# EAGLE design MainSchematic_F1 (EAGLE 9.5.1)
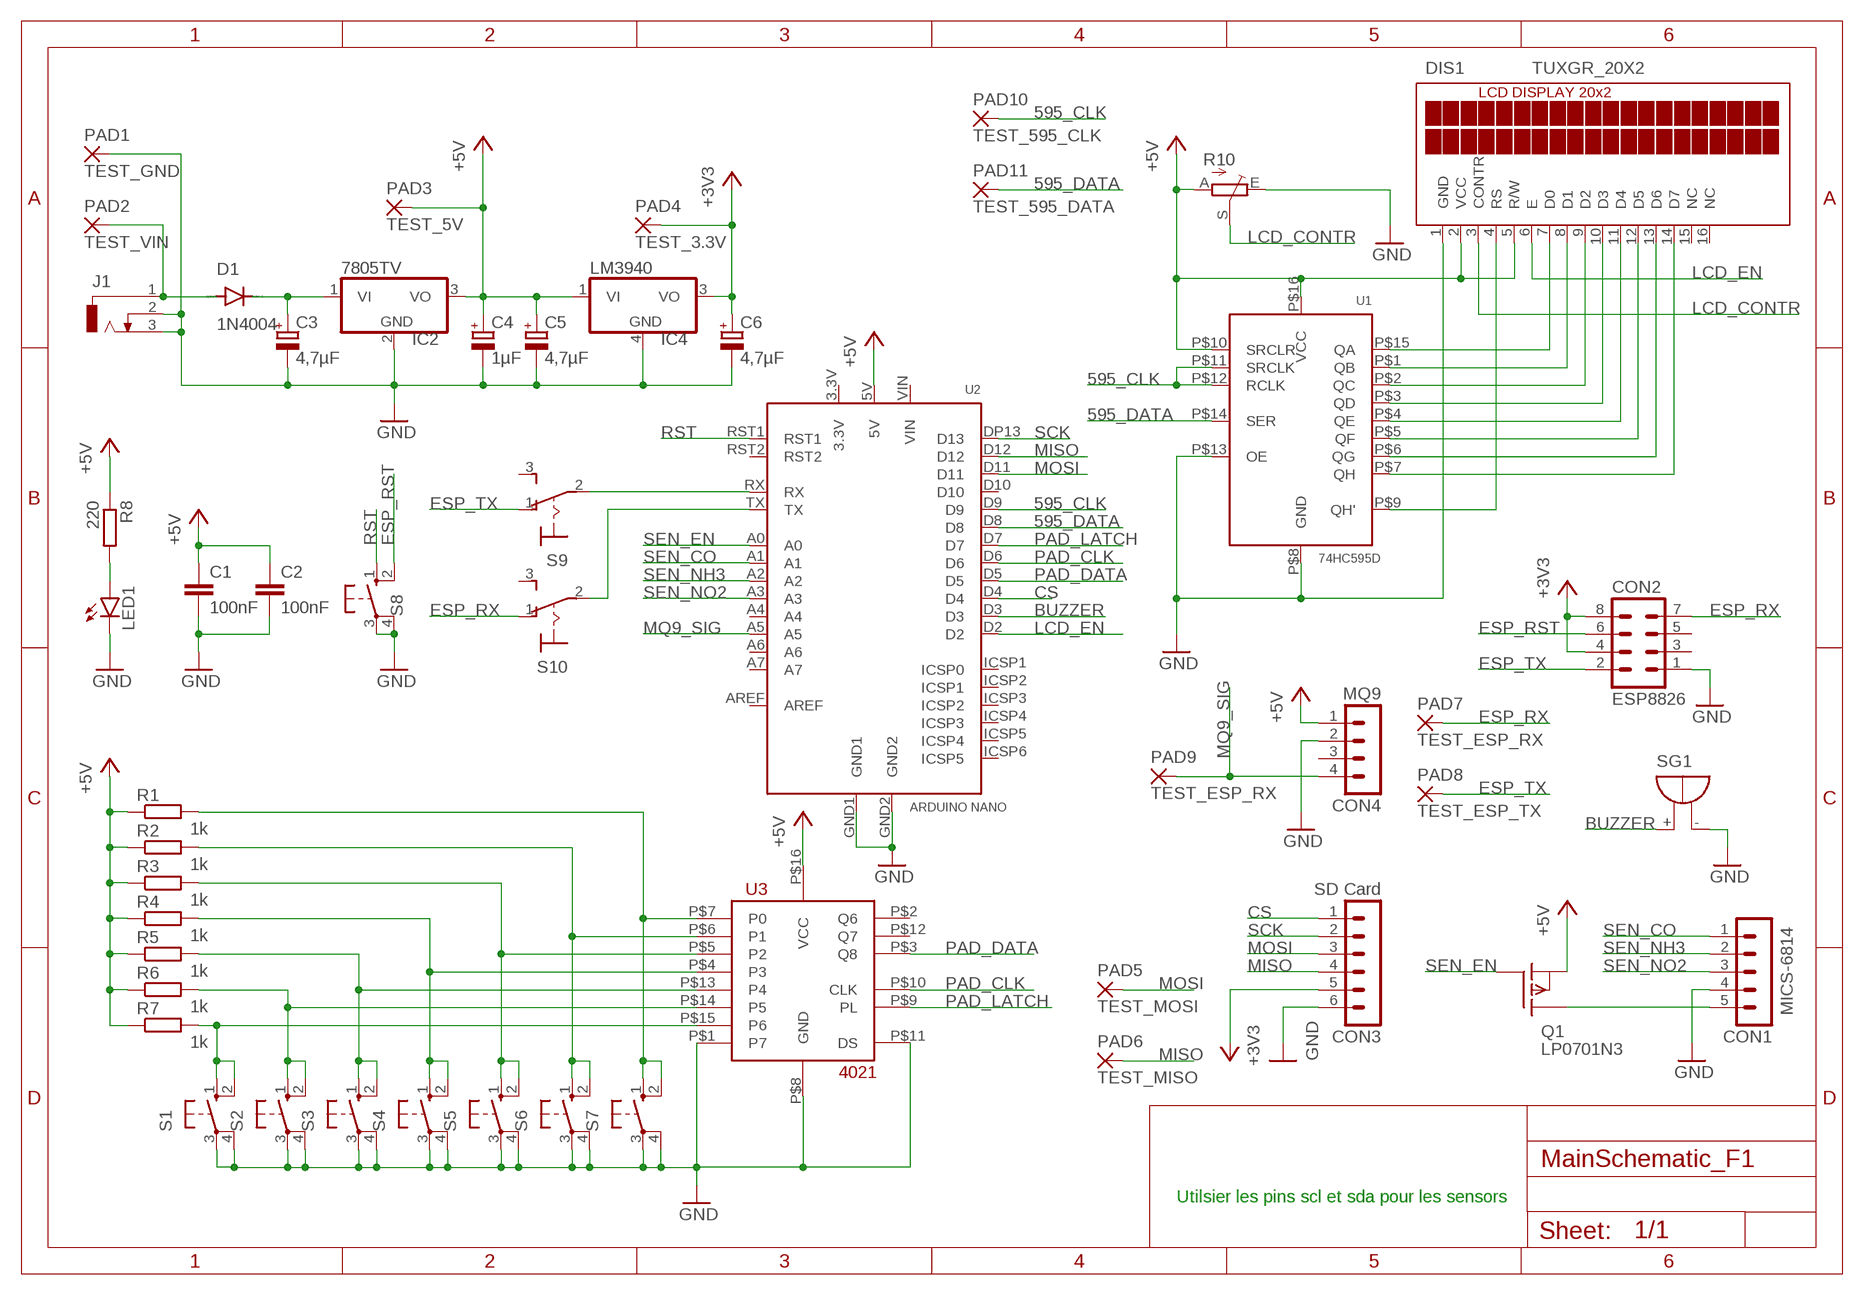
[diagram p0: schematic, sheet 1]

## Parts
C1  100nF  C5/2.5  [C5B2.5]
C2  100nF  C5/2.5  [C5B2.5]
C3  4,7µF  CPOL-EUE2,5-6E  [E2,5-6E]
C4  1µF  CPOL-EUE2,5-6E  [E2,5-6E]
C5  4,7µF  CPOL-EUE2,5-6E  [E2,5-6E]
C6  4,7µF  CPOL-EUE2,5-6E  [E2,5-6E]
CON1  MICS-6814  MA05-1  [MA05-1]
CON2  ESP8826  MA04-2  [MA04-2]
CON3  SD Card  MA06-1  [MA06-1]
CON4  MQ9  MA04-1  [MA04-1]
D1  1N4004  [DO41-10]
DIS1  TUXGR_20X2  [TUXGR_20X2]
IC2  7805TV  [TO220V]
IC4  LM3940  LM340MP-05  [SOT223]
J1  DCJ0303  [DCJ0303]
LED1  LED3MM  [LED3MM]
PAD1  TEST_GND  WIREPAD2,54/0,9  [2,54/0,9]
PAD2  TEST_VIN  WIREPAD2,54/0,9  [2,54/0,9]
PAD3  TEST_5V  WIREPAD2,54/0,9  [2,54/0,9]
PAD4  TEST_3.3V  WIREPAD2,54/0,9  [2,54/0,9]
PAD5  TEST_MOSI  WIREPAD2,54/0,9  [2,54/0,9]
PAD6  TEST_MISO  WIREPAD2,54/0,9  [2,54/0,9]
PAD7  TEST_ESP_RX  WIREPAD2,54/0,9  [2,54/0,9]
PAD8  TEST_ESP_TX  WIREPAD2,54/0,9  [2,54/0,9]
PAD9  TEST_ESP_RX  WIREPAD2,54/0,9  [2,54/0,9]
PAD10  TEST_595_CLK  WIREPAD2,54/0,9  [2,54/0,9]
PAD11  TEST_595_DATA  WIREPAD2,54/0,9  [2,54/0,9]
Q1  LP0701N3  [TO-92]
R1  1k  R-EU_0204/7  [0204/7]
R2  1k  R-EU_0204/7  [0204/7]
R3  1k  R-EU_0204/7  [0204/7]
R4  1k  R-EU_0204/7  [0204/7]
R5  1k  R-EU_0204/7  [0204/7]
R6  1k  R-EU_0204/7  [0204/7]
R7  1k  R-EU_0204/7  [0204/7]
R8  220  R-EU_0204/7  [0204/7]
R10  TRIM_EU-RJ9W  [RJ9W]
S1  10-XX  [B3F-10XX]
S2  10-XX  [B3F-10XX]
S3  10-XX  [B3F-10XX]
S4  10-XX  [B3F-10XX]
S5  10-XX  [B3F-10XX]
S6  10-XX  [B3F-10XX]
S7  10-XX  [B3F-10XX]
S8  10-XX  [B3F-10XX]
S9  320-916  [320-916]
S10  320-916  [320-916]
SG1  F/TMB  [F/TMB]
U1  74HC595D  74HC595D_SOP16  [SOP-16]
U2  ARDUINO NANO  ARDUINO_NANO_SOCKET  [SOCKET_NANO]
U3  4021  [DIP]

## Nets
595_CLK: PAD10.1(P) U1.P$11(SRCLK) U1.P$12(RCLK) U2.D9
595_DATA: PAD11.1(P) U1.P$14(SER) U2.D8
+3V3: C6.+ CON2.4 CON2.8 CON3.5 IC4.3(VO) PAD4.1(P)
+5V: C1.1 C2.1 C4.+ C5.+ CON4.1 DIS1.2(VCC) DIS1.5(R/W) IC2.3(VO) IC4.1(VI) PAD3.1(P) Q1.1(S) R1.1 R2.1 R3.1 R4.1 R5.1 R6.1 R7.1 R8.1 R10.A U1.P$10(SRCLR) U1.P$16(VCC) U2.5V U3.P$16(VCC)
BUZZER: SG1.+ U2.D3
CS: CON3.1 U2.D4
ESP_RST: CON2.6 S8.2(S1)
ESP_RX: CON2.7 PAD7.1(P) S10.1(O)
ESP_TX: CON2.2 PAD8.1(P) S9.1(O)
GND: C1.2 C2.2 C3.- C4.- C5.- C6.- CON1.4 CON2.1 CON3.6 CON4.2 DIS1.1(GND) IC2.2(GND) IC4.4(GND) J1.2 J1.3 LED1.K(C) PAD1.1(P) R10.E S1.3(P) S1.4(P1) S2.3(P) S2.4(P1) S3.3(P) S3.4(P1) S4.3(P) S4.4(P1) S5.3(P) S5.4(P1) S6.3(P) S6.4(P1) S7.3(P) S7.4(P1) S8.3(P) S8.4(P1) SG1.- U1.P$8(GND) U1.P$13(OE) U2.GND1 U2.GND2 U3.P$1(P7) U3.P$8(GND) U3.P$11(DS)
LCD_CONTR: DIS1.3(CONTR) R10.S
LCD_EN: DIS1.6(E) U2.D2
MISO: CON3.4 PAD6.1(P) U2.D12
MOSI: CON3.3 PAD5.1(P) U2.D11
MQ9_SIG: CON4.4 PAD9.1(P) U2.A5
N$1: LED1.A R8.2
N$3: DIS1.7(D0) U1.P$15(QA)
N$4: DIS1.8(D1) U1.P$1(QB)
N$5: DIS1.9(D2) U1.P$2(QC)
N$6: DIS1.10(D3) U1.P$3(QD)
N$7: DIS1.11(D4) U1.P$4(QE)
N$8: DIS1.12(D5) U1.P$5(QF)
N$9: DIS1.13(D6) U1.P$6(QG)
N$10: DIS1.14(D7) U1.P$7(QH)
N$11: R7.2 S1.1(S) S1.2(S1) U3.P$15(P6)
N$12: DIS1.4(RS) U1.P$9(QH')
N$13: R6.2 S2.1(S) S2.2(S1) U3.P$14(P5)
N$14: R5.2 S3.1(S) S3.2(S1) U3.P$13(P4)
N$15: R4.2 S4.1(S) S4.2(S1) U3.P$4(P3)
N$16: R3.2 S5.1(S) S5.2(S1) U3.P$5(P2)
N$17: R2.2 S6.1(S) S6.2(S1) U3.P$6(P1)
N$18: R1.2 S7.1(S) S7.2(S1) U3.P$7(P0)
N$20: D1.A J1.1 PAD2.1(P)
N$21: C3.+ D1.C IC2.1(VI)
N$22: S9.2(P) U2.RX
N$23: S10.2(P) U2.TX
N$26: CON1.5 Q1.3(D)
PAD_CLK: U2.D6 U3.P$10(CLK)
PAD_DATA: U2.D5 U3.P$3(Q8)
PAD_LATCH: U2.D7 U3.P$9(PL)
RST: S8.1(S) U2.RST1
SCK: CON3.2 U2.DP13(D13)
SEN_CO: CON1.1 U2.A1
SEN_EN: Q1.2(G) U2.A0
SEN_NH3: CON1.2 U2.A2
SEN_NO2: CON1.3 U2.A3
Unconnected: CON2.3 CON2.5 CON4.3 DIS1.15(NC) DIS1.16(NC) S9.3(S) S10.3(S) U2.A4 U2.A6 U2.A7 U2.AREF U2.D10 U2.ICSP1(ICSP0) U2.ICSP2(ICSP1) U2.ICSP3(ICSP2) U2.ICSP4(ICSP3) U2.ICSP5(ICSP4) U2.ICSP6(ICSP5) U2.RST2 U3.P$2(Q6) U3.P$12(Q7)

## Notes on the sheet
- Utilsier les pins scl et sda pour les sensors

## Power pins joined to a net without a drawn wire
3.3V: U2.3.3V
VIN: U2.VIN

## Library data of the parts
C1 C2 = capacitor-wima:C: CAPACITOR naming: grid - package width
C3-C6 = rcl:CPOL-EU: POLARIZED CAPACITOR, European symbol; SPICEPREFIX: C
CON1 = con-lstb:MA05-1: PIN HEADER; OC_FARNELL: unknown; OC_NEWARK: unknown
CON2 = con-lstb:MA04-2: PIN HEADER; OC_FARNELL: unknown; OC_NEWARK: unknown
CON3 = con-lstb:MA06-1: PIN HEADER; OC_FARNELL: unknown; OC_NEWARK: unknown
CON4 = con-lstb:MA04-1: PIN HEADER; OC_FARNELL: unknown; OC_NEWARK: unknown
D1 = diode:1N4004: DIODE general purpose rectifier, 1 A
DIS1 = display-lcd:TUXGR_20X2: Tuxgraphics LCD display 20x2 characters reflective, without background light Source: tuxgr_20x2.pdf; OC_FARNELL: unknown; OC_NEWARK: unknown
IC2 = linear:78*: Positive VOLTAGE REGULATOR Source: http://cache.national.com/ds/LM/LM78L05.pdf http://www.fairchildsemi.com/ds/LM/LM7805.pdf
IC4 = linear:LM340?-*: Positive VOLTAGE REGULATOR Source: http://cache.national.com/ds/LM/LM340.pdf
J1 = con-jack:DCJ0303: DC POWER JACK Source: DCJ0303.pdf; OC_FARNELL: unknown; OC_NEWARK: unknown
LED1 = led:LED: LED OSRAM: - CHIPLED LG R971, LG N971, LY N971, LG Q971, LY Q971, LO R971, LY R971 LH N974, LH R974 LS Q976, LO Q976, LY Q976 LO Q996 - Hyper CHIPLED LW Q18S LB Q993, LB Q99A, LB R99A - SideLED LS A670, LO A670, LY A670, LG A670, LP A670 LB A673, LV A673, LT A673, LW A673 LH A674 LY A675 LS A676, LA A676, LO A676, LY A676, LW A676 LS A679, LY A679, LG A679 - Hyper Micro SIDELED® LS Y876, LA Y876, LO Y876, LY Y876 LT Y87S - SmartLED LW L88C, LW L88S LB L89C, LB L89S, LG L890 LS L89K, LO L89K, LY L89K LS L896, LA L896, LO L896, LY L896 - TOPLED LS T670, LO T670, LY T670, LG T670, LP T670 LSG T670, LSP T670, LSY T670, LOP T670, LYG T670 LG T671, LOG T671, LSG T671 LB T673, LV T673, LT T673, LW T673 LH T674 LS T676, LA T676, LO T676, LY T676, LB T676, LH T676, LSB T676, LW T676 LB T67C, LV T67C, LT T67C, LS T67K, LO T67K, LY T67K, LW E67C LS E67B, LA E67B, LO E67B, LY E67B, LB E67C, LV E67C, LT E67C LW T67C LS T679, LY T679, LG T679 LS T770, LO T770, LY T770, LG T770, LP T770 LB T773, LV T773, LT T773, LW T773 LH T774 LS E675, LA E675, LY E675, LS T675 LS T776, LA T776, LO T776, LY T776, LB T776 LHGB T686 LT T68C, LB T68C - Hyper Mini TOPLED® LB M676 - Mini TOPLED Santana® LG M470 LS M47K, LO M47K, LY M47K Source: http://www.osram.convergy.de LUXEON: - LUMILED® LXK2-PW12-R00, LXK2-PW12-S00, LXK2-PW14-U00, LXK2-PW14-V00 LXK2-PM12-R00, LXK2-PM12-S00, LXK2-PM14-U00 LXK2-PE12-Q00, LXK2-PE12-R00, LXK2-PE12-S00, LXK2-PE14-T00, LXK2-PE14-U00 LXK2-PB12-K00, LXK2-PB12-L00, LXK2-PB12-M00, LXK2-PB14-N00, LXK2-PB14-P00, LXK2-PB14-Q00 LXK2-PR12-L00, LXK2-PR12-M00, LXK2-PR14-Q00, LXK2-PR14-R00 LXK2-PD12-Q00, LXK2-PD12-R00, LXK2-PD12-S00 LXK2-PH12-R00, LXK2-PH12-S00 LXK2-PL12-P00, LXK2-PL12-Q00, LXK2-PL12-R00 Source: www.luxeon.com KINGBRIGHT: KA-3528ASYC Source: www.kingbright.com
PAD1-PAD11 = wirepad:WIREPAD: Wire PAD connect wire on PCB
Q1 = transistor-fet:LP0701N3: P-Channel Enhancement MOSFET -16,5V; -1,25A; 1,5Ohm
R1-R8 = rcl:R-EU_: RESISTOR, European symbol; SPICEPREFIX: R
R10 = pot:TRIM_EU-: POTENTIOMETER
S1-S8 = switch-omron:10-XX: OMRON SWITCH; MPN: B3F-1000; OC_FARNELL: 176432; OC_NEWARK: 36M3542
S9 S10 = switch:320-916: TOGGLE SWITCH distributor RS Components
SG1 = buzzer:F/TMB: BUZZER Source: Buerklin; OC_FARNELL: unknown; OC_NEWARK: unknown
U1 = 74-series-ajouts:74HC595D_SOP16
U2 = arduino-sockets:ARDUINO_NANO_SOCKET
U3 = 4021:4021

## Board
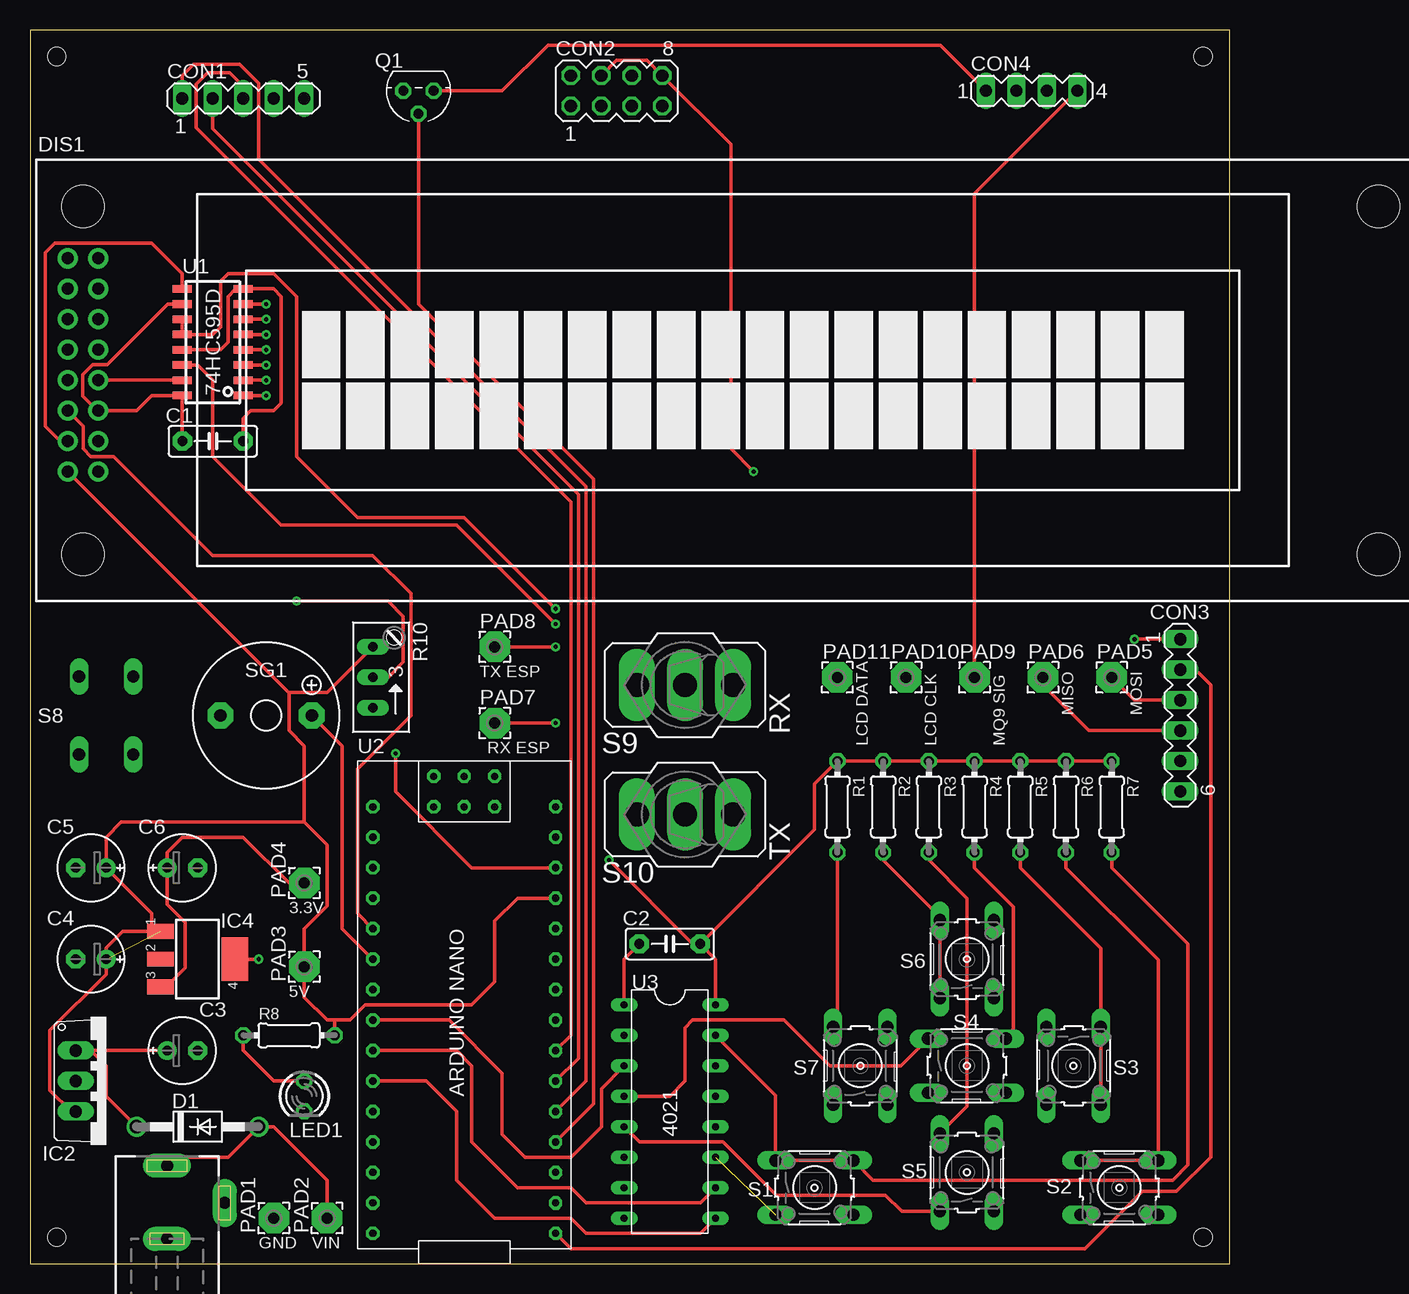
[diagram p1: board, top side]
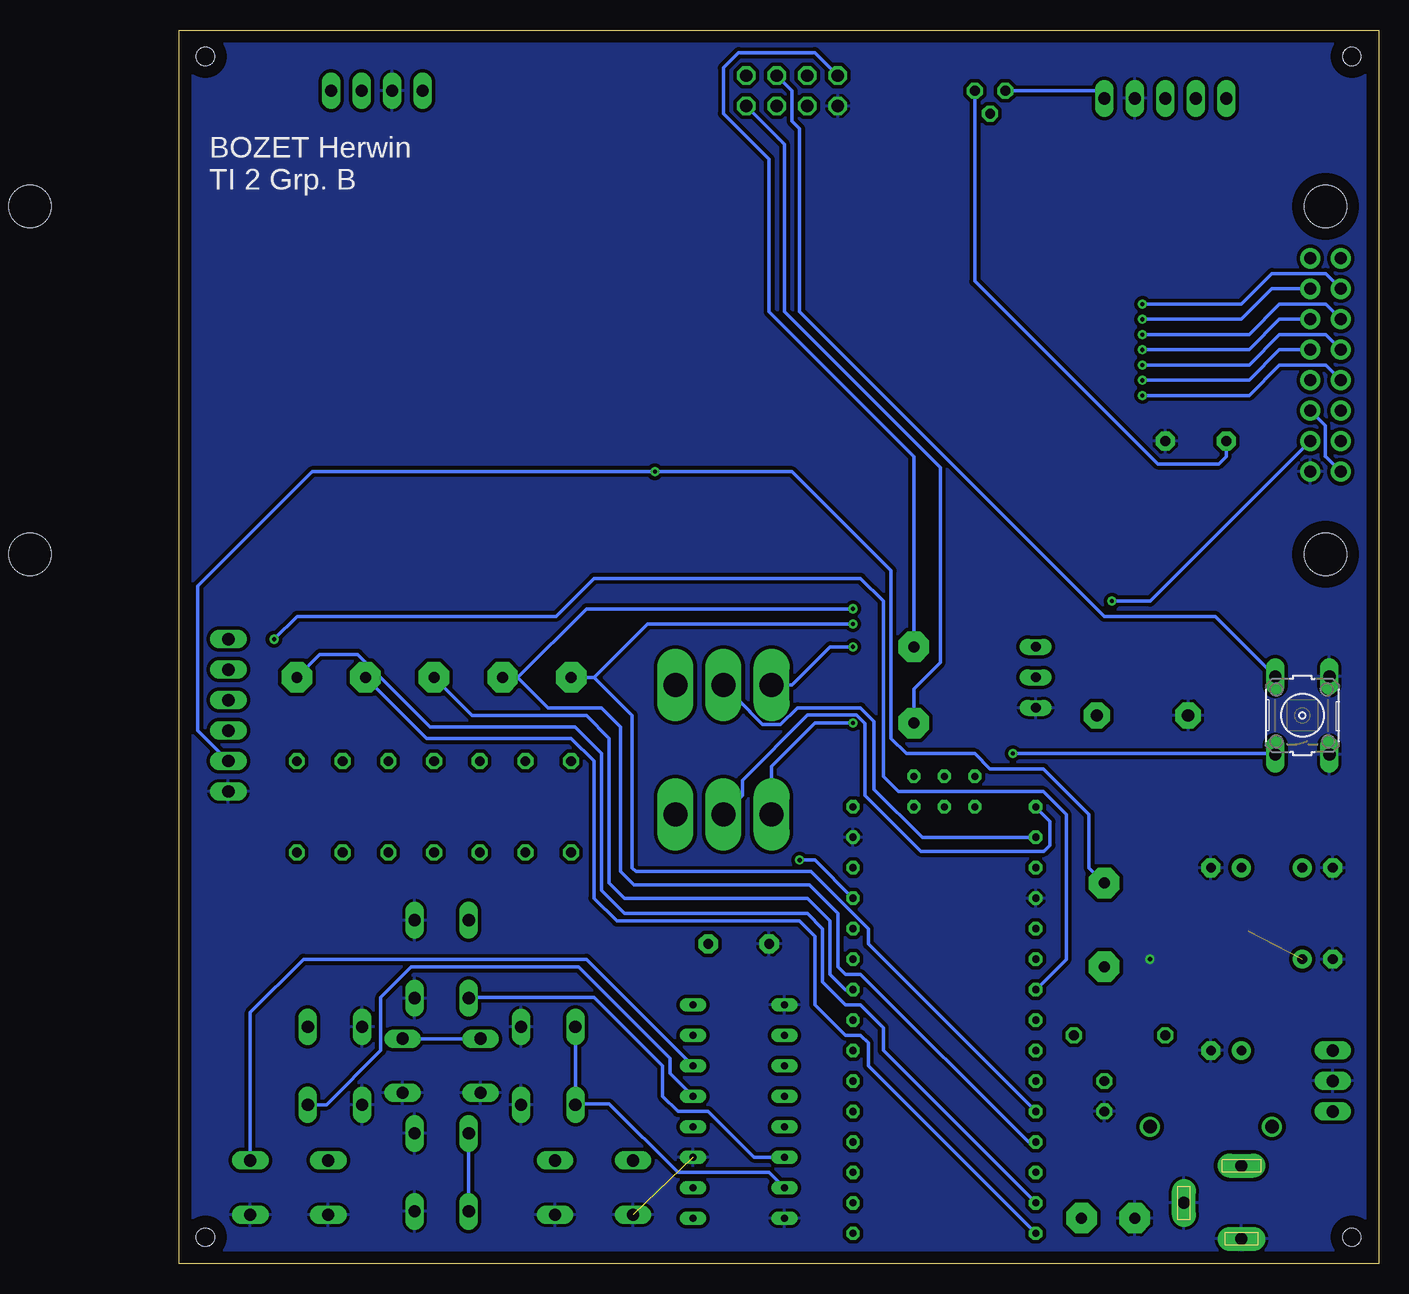
[diagram p2: board, bottom side, seen from below]

Size 100 x 102.86 mm. Coordinates in mm from the lower left corner, seen from the top.
Outline: 0,0 100,0 100,102.86 0,102.86 0,0
Copper layers (1*16): Top 0.035mm / dielectric 1.5mm / Bottom 0.035mm
Design rules "default": minimum track width 6mil, minimum drill 0.35mm, track to track 6mil, track to pad 6mil, pad to pad 6mil, via to via 6mil, smd to smd 6mil, copper to edge 40mil, drill to drill 6mil, minimum pad ring 10mil, minimum via ring 8mil, stop-mask expansion 4mil, vias tented up to drill 0mil, thermal gap 10mil
Holes 1.5 mm at 2.22,2.22 97.79,2.22 2.22,100.65 97.79,100.65

### Footprints (pad centres in the part's own frame; a part is rotated, then mirrored left to right if it is on the bottom)
C5B2.5 = drill 0.813 pad 1.6 octagon: 1 -2.54,0; 2 2.54,0
E2,5-6E = drill 0.813 pad 1.575: + -1.27,0 | drill 0.813 pad 1.575 octagon: - 1.27,0
MA05-1 = drill 1.016 long: 1 -5.08,0; 2 -2.54,0; 3 0,0; 4 2.54,0; 5 5.08,0
MA04-2 = drill 1.016 octagon: 1 -3.81,-1.27; 2 -3.81,1.27; 3 -1.27,-1.27; 4 -1.27,1.27; 5 1.27,-1.27; 6 1.27,1.27; 7 3.81,-1.27; 8 3.81,1.27
MA06-1 = drill 1.016 long: 1 -6.35,0; 2 -3.81,0; 3 -1.27,0; 4 1.27,0; 5 3.81,0; 6 6.35,0
MA04-1 = drill 1.016 long: 1 -3.81,0; 2 -1.27,0; 3 1.27,0; 4 3.81,0
DO41-10 = drill 1.118: A 5.08,0; C -5.08,0
TUXGR_20X2 = drill 1 pad 1.676: 1 -52.73,-7.62; 2 -55.27,-7.62; 3 -52.73,-5.08; 4 -55.27,-5.08; 5 -52.73,-2.54; 6 -55.27,-2.54; 7 -52.73,0; 8 -55.27,0; 9 -52.73,2.54; 10 -55.27,2.54; 11 -52.73,5.08; 12 -55.27,5.08; 13 -52.73,7.62; 14 -55.27,7.62; 15 -52.73,10.16; 16 -55.27,10.16 | hole 3.5: -54,-14.5; 54,-14.5; -54,14.5; 54,14.5
TO220V = drill 1.016 long: 1 -2.54,-2.54; 2 0,-2.54; 3 2.54,-2.54
SOT223 = smd 1.219 x 2.235: 1 -2.311,-3.099; 2 0,-3.099; 3 2.311,-3.099 | smd 3.6 x 2.2: 4 0,3.099
DCJ0303 = drill 1 pad 2 long: 1 0,3.1; 2 4.8,0; 3 0,-3
LED3MM = drill 0.813 octagon: A -1.27,0; K 1.27,0
2,54/0,9 = drill 0.914 pad 2.54 octagon: 1 0,0
TO-92 = drill 0.813 octagon: 1 -1.27,0; 2 0,1.905; 3 1.27,0
0204/7 = drill 0.813 octagon: 1 -3.81,0; 2 3.81,0
RJ9W = drill 0.813 long: A 2.54,0.635; E -2.54,0.635; S 0,0.635
B3F-10XX = drill 1.016 long: 1 -3.251,2.261; 2 3.251,2.261; 3 -3.251,-2.261; 4 3.251,-2.261
320-916 = drill 2.007 long: 1 0,4.013; 2 0,0; 3 0,-4.013
F/TMB = drill 1.016 pad 2.159 octagon: + 3.81,0; - -3.81,0
SOP-16 = smd 0.635 x 1.587: P$1 0,-5.08; P$2 1.27,-5.08; P$3 2.54,-5.08; P$4 3.81,-5.08; P$5 5.08,-5.08; P$6 6.35,-5.08; P$7 7.62,-5.08; P$8 8.89,-5.08; P$9 8.89,0; P$10 7.62,0; P$11 6.35,0; P$12 5.08,0; P$13 3.81,0; P$14 2.54,0; P$15 1.27,0; P$16 0,0
SOCKET_NANO = drill 0.6 octagon: 3.3V -7.62,10.16; 5V -7.62,-15.24; A0 -7.62,5.08; A1 -7.62,2.54; A2 -7.62,0; A3 -7.62,-2.54; A4 -7.62,-5.08; A5 -7.62,-7.62; A6 -7.62,-10.16; A7 -7.62,-12.7; AREF -7.62,7.62; D2 7.62,-12.7; D3 7.62,-10.16; D4 7.62,-7.62; D5 7.62,-5.08; D6 7.62,-2.54; D7 7.62,0; D8 7.62,2.54; D9 7.62,5.08; D10 7.62,7.62; D11 7.62,10.16; D12 7.62,12.7; DP13 -7.62,12.7; GND1 -7.62,-20.32; GND2 7.62,-15.24; ICSP1 -2.54,-25.4; ICSP2 0,-25.4; ICSP3 2.54,-25.4; ICSP4 -2.54,-22.86; ICSP5 0,-22.86; ICSP6 2.54,-22.86; RST1 -7.62,-17.78; RST2 7.62,-17.78; RX 7.62,-20.32; TX 7.62,-22.86; VIN -7.62,-22.86
DIP = drill 0.6 long: P$1 -12.7,-2.54; P$2 -10.16,-2.54; P$3 -7.62,-2.54; P$4 -5.08,-2.54; P$5 -2.54,-2.54; P$6 0,-2.54; P$7 2.54,-2.54; P$8 5.08,-2.54; P$9 5.08,5.08; P$10 2.54,5.08; P$11 0,5.08; P$12 -2.54,5.08; P$13 -5.08,5.08; P$14 -7.62,5.08; P$15 -10.16,5.08; P$16 -12.7,5.08

### Placement (x,y rotation side)
C1  15.24,68.58 0 top
C2  53.34,26.67 180 top
C3  12.7,17.78 0 top
C4  5.08,25.4 180 top
C5  5.08,33.02 180 top
C6  12.7,33.02 0 top
CON1  17.78,97.16 0 top
CON2  48.9,97.79 0 top
CON3  95.89,45.72 270 top
CON4  83.5,97.79 0 top
D1  13.97,11.43 0 top
DIS1  58.42,73.66 0 top
IC2  6.35,15.24 270 top
IC4  13.97,25.4 270 top
J1  11.43,5.08 0 top
LED1  22.86,13.97 270 top
PAD1  20.32,3.81 0 top
PAD2  24.77,3.81 0 top
PAD3  22.86,24.77 0 top
PAD4  22.86,31.75 0 top
PAD5  90.17,48.9 0 top
PAD6  84.45,48.9 0 top
PAD7  38.73,45.09 0 top
PAD8  38.73,51.44 0 top
PAD9  78.74,48.9 0 top
PAD10  73.03,48.9 0 top
PAD11  67.31,48.9 0 top
Q1  32.38,97.79 180 top
R1  67.31,38.1 270 top
R2  71.12,38.1 270 top
R3  74.93,38.1 270 top
R4  78.74,38.1 270 top
R5  82.55,38.1 270 top
R6  86.36,38.1 270 top
R7  90.17,38.1 270 top
R8  21.59,19.05 180 top
R10  29.21,48.9 90 top
S1  65.41,6.35 0 top
S2  90.81,6.35 0 top
S3  87,16.51 270 top
S4  78.11,16.51 0 top
S5  78.11,7.62 90 top
S6  78.11,25.4 90 top
S7  69.22,16.51 90 top
S8  6.35,45.72 90 bottom
S9  54.61,48.26 90 top
S10  54.61,37.47 90 top
SG1  19.68,45.72 0 top
U1  12.7,72.39 90 top
U2  36.2,15.24 180 top
U3  52.07,8.89 270 top

### Tracks (layer width: path | path; a pad name or v marks a point on that pad's centre or on a via)
595_CLK  (via drill 0.35)
  Top 0.305: U1.P$11 U1.P$12 15.24,77.47 15.88,78.11 15.88,81.92 16.51,82.55 20.32,82.55 22.23,80.64 22.23,67.31 27.3,62.23 36.2,62.23 v43.81,54.61
  Bottom 0.305: U2.D9 29.21,10.16 43.18,24.13 44.45,24.13 45.09,24.77 45.09,29.21 47.45,31.57 62.05,31.57 63.18,32.7 63.18,44.77 64.77,46.35 69.22,46.35 71.75,48.9 | v43.81,54.61 66.04,54.61 71.75,48.9 | 71.75,48.9 PAD10.1
595_DATA  (via drill 0.35)
  Top 0.305: U1.P$14 13.97,74.93 15.24,73.66 15.24,67.31 20.95,61.59 35.56,61.59 v43.81,53.34
  Bottom 0.305: U2.D8 42.55,26.67 42.55,27.94 47.31,32.7 61.91,32.7 62.23,33.02 62.23,45.72 65.41,48.9 | PAD11.1 65.41,48.9 | 65.41,48.9 60.96,53.34 v43.81,53.34
+3V3  (via drill 0.35)
  Top 0.152: 11.43,23.09 IC4.3
  Top 0.305: CON2.4 48.9,100.33 51.44,100.33 CON2.8 58.42,93.34 58.42,67.94 v60.33,66.04 | 11.43,23.09 11.43,23.17 12.93,24.66 12.93,28.45 11.43,29.95 C6.+ 11.43,34.29 12.7,35.56 17.78,35.56 21.59,31.75 PAD4.1
  Bottom 0.305: CON3.5 98.42,44.45 98.42,56.52 88.9,66.04 v60.33,66.04 48.9,66.04 40.64,57.78 40.64,43.81 39.37,42.55 33.66,42.55 32.38,41.27 27.94,41.27 24.13,37.47 24.13,33.02 PAD4.1
+5V  (via drill 0.35)  (1 unrouted)
  Top 0.305: C2.1 57.15,25.4 U3.P$16 | R7.1 R6.1 R5.1 R4.1 R3.1 R2.1 R1.1 65.41,40.01 65.41,36.2 C2.1 | IC2.3 3.44,12.7 1.66,14.48 1.66,19.44 6.35,24.13 C4.+ 6.35,26.35 7.71,27.71 10.16,27.71 10.16,29.21 C5.+ 6.35,35.56 7.62,36.83 22.86,36.83 | 22.86,36.83 24.77,34.92 24.77,29.84 22.86,27.94 PAD3.1 22.86,22.23 24.77,20.32 25.4,20.32 | R8.1 25.4,20.32 | C1.1 U1.P$16 10.16,72.39 8.89,71.12 DIS1.5 5.58,71.12 4.38,72.33 4.38,74.13 5.22,74.97 6.44,74.97 11.47,80.01 U1.P$10 | 25.4,20.32 26.67,20.32 27.94,21.59 36.83,21.59 38.73,23.5 38.73,28.57 40.64,30.48 U2.5V | 21.59,47.62 21.57,47.62 DIS1.2 | 22.86,36.83 22.86,43.18 21.59,44.45 21.59,47.62 | Q1.1 39.37,97.79 43.18,101.6 75.88,101.6 CON4.1 | C2.1 55.24,26.67 v48.26,33.66 | R10.A 24.77,47.62 21.59,47.62
  Bottom 0.305: DIS1.2 4.42,67.31 4.45,67.31 4.45,69.88 DIS1.5 | C1.1 12.7,67.31 13.34,66.67 18.41,66.67 33.66,81.92 Q1.1 | U2.5V 46.99,33.66 v48.26,33.66
BUZZER
  Top 0.305: U2.D3 26.04,27.94 26.04,43.18 SG1.+
CS  (via drill 0.35)
  Top 0.305: CON3.1 v92.08,52.07
  Bottom 0.305: v92.08,52.07 90.17,53.98 68.58,53.98 65.41,57.15 43.18,57.15 41.27,55.24 41.27,40.64 40.01,39.37 27.95,39.37 26.04,37.45 26.04,25.4 U2.D4
ESP_RST
  Bottom 0.305: S8.2 13.61,53.98 22.86,53.98 48.26,79.38 48.26,94.61 48.9,95.25 48.9,97.79 CON2.6
ESP_RX  (via drill 0.35)
  Top 0.305: PAD7.1 v43.81,45.09
  Bottom 0.305: PAD7.1 38.73,47.94 36.52,50.15 36.52,66.37 49.53,79.38 49.53,93.34 CON2.7 | S10.1 50.6,41.48 46.99,45.09 v43.81,45.09
ESP_TX  (via drill 0.35)
  Top 0.305: PAD8.1 v43.81,51.44
  Bottom 0.305: PAD8.1 38.73,67.3 50.81,79.37 50.81,92.08 54.61,95.89 54.61,99.69 53.34,100.97 46.99,100.97 CON2.2 | S9.1 48.9,48.26 45.72,51.44 v43.81,51.44
GND  (via drill 0.35)  (1 unrouted)
  Top 0.305: IC4.4 v19.05,25.4 | C2.2 49.53,25.4 U3.P$1 | C1.2 17.78,70.48 18.41,71.12 20.32,71.12 20.95,71.75 20.95,80.64 20.32,81.28 U1.P$8 17.14,81.28 16.51,80.64 16.51,76.83 15.88,76.2 U1.P$13
  pour Bottom (isolate 0.305): 0,102.87 100.01,102.87 100.01,0 0,0
LCD_CONTR  (via drill 0.35)
  Top 0.305: R10.S 29.84,48.9 31.11,50.16 31.11,53.98 29.84,55.24 v22.23,55.24
  Bottom 0.305: DIS1.3 19.02,55.24 v22.23,55.24
LCD_EN
  Top 0.305: DIS1.6 4.45,69.83 4.45,67.94 5.08,67.31 6.99,67.31 15.24,59.05 28.57,59.05 31.75,55.88 31.75,45.72 27.3,41.27 27.3,29.21 U2.D2
MISO
  Top 0.305: CON3.4 88.27,44.45 84.45,48.26 PAD6.1
  Bottom 0.305: U2.D12 42.55,16.51 42.55,18.41 43.18,19.05 44.45,19.05 46.99,21.59 46.99,27.3 48.26,28.57 63.5,28.57 65.41,30.48 65.41,41.91 67.31,43.81 79.38,43.81 PAD6.1
MOSI
  Top 0.305: CON3.3 92.08,46.99 PAD5.1
  Bottom 0.305: U2.D11 41.27,17.78 41.27,19.68 43.18,21.59 44.45,21.59 46.35,23.5 46.35,27.94 47.62,29.21 62.87,29.21 64.78,31.12 64.78,42.54 67,44.76 79.05,44.76 85.09,50.8 88.27,50.8 PAD5.1
MQ9_SIG
  Top 0.305: CON4.4 78.74,89.22 PAD9.1
  Bottom 0.305: U2.A5 44.45,22.86 45.72,24.13 45.72,28.57 47.62,30.48 62.87,30.48 64.14,31.75 64.14,43.81 66.04,45.72 75.56,45.72 PAD9.1
N$1
  Top 0.305: LED1.A 20.32,15.24 17.78,17.78 R8.2
N$3
  Top 0.305: U1.P$15 DIS1.7
N$4  (via drill 0.35)
  Top 0.305: U1.P$1 v19.68,72.39
  Bottom 0.305: DIS1.8 4.42,74.93 8.26,74.93 10.79,72.39 v19.68,72.39
N$5  (via drill 0.35)
  Top 0.305: v19.68,73.66 U1.P$2
  Bottom 0.305: DIS1.9 8.26,76.2 10.79,73.66 v19.68,73.66
N$6  (via drill 0.35)
  Top 0.305: U1.P$3 v19.68,74.93
  Bottom 0.305: v19.68,74.93 10.79,74.93 8.26,77.47 4.42,77.47 DIS1.10
N$7  (via drill 0.35)
  Top 0.305: v19.68,76.2 U1.P$4
  Bottom 0.305: DIS1.11 8.26,78.74 10.79,76.2 v19.68,76.2
N$8  (via drill 0.35)
  Top 0.305: U1.P$5 v19.68,77.47
  Bottom 0.305: v19.68,77.47 10.79,77.47 8.26,80.01 4.42,80.01 DIS1.12
N$9  (via drill 0.35)
  Top 0.305: v19.68,78.74 U1.P$6
  Bottom 0.305: DIS1.13 8.89,81.28 11.43,78.74 v19.68,78.74
N$10  (via drill 0.35)
  Top 0.305: U1.P$7 v19.68,80.01
  Bottom 0.305: v19.68,80.01 11.43,80.01 8.89,82.55 4.42,82.55 DIS1.14
N$11
  Top 0.305: R7.2 90.17,33.02 96.52,26.67 96.52,8.26 95.25,6.99 70.28,6.99 S1.2 S1.1 62.15,14.05 U3.P$15
N$12
  Top 0.305: U1.P$9 12.7,82.55 10.16,85.09 2.06,85.09 1.27,84.3 1.27,69.85 2.54,68.58 DIS1.4
N$13
  Top 0.305: R6.2 86.36,33.02 94.06,25.32 S2.2 S2.1 86.72,8.61
  Bottom 0.305: S2.2 94.06,20.95 89.61,25.4 66.04,25.4 U3.P$14
N$14
  Top 0.305: R5.2 82.55,33.02 89.26,26.31 S3.1 S3.2
  Bottom 0.305: S3.2 87.71,13.26 83.19,17.78 83.19,22.23 80.64,24.77 66.67,24.77 59.05,17.14 59.05,15.88 U3.P$13
N$15
  Top 0.305: S4.2 81.36,18.96 82,19.6 82,29.76 78.74,33.02 R4.2 | 74.85,18.34 S4.1 72.59,16.51 66.67,16.51 62.87,20.32 55.24,20.32 54.61,19.68 54.61,15.24 53.34,13.97 U3.P$4
  Bottom 0.305: S4.2 S4.1
N$16
  Top 0.305: R3.2 74.93,33.66 78.11,30.48 78.11,13.13 S5.2 | U3.P$5 50.8,10.16 57.78,10.16 62.23,5.71 71.32,5.71 72.67,4.37 S5.1
  Bottom 0.305: S5.2 S5.1
N$17
  Top 0.305: S6.1 S6.2 75.84,28.93 71.12,33.66 R2.2
  Bottom 0.305: U3.P$6 52.07,8.89 55.88,12.7 58.42,12.7 59.69,13.97 59.69,16.51 65.41,22.23 75.77,22.23 S6.1
N$18
  Top 0.305: R1.2 67.31,20.12 S7.2
  Bottom 0.305: S7.2 S7.1 66.88,13.34 64.14,13.34 58.42,7.62 50.8,7.62 U3.P$7
N$20
  Top 0.305: J1.1 12.14,8.89 16.51,8.89 D1.A 20.32,11.43 24.77,6.99 PAD2.1
N$21
  Top 0.305: IC2.1 5.08,17.78 | 5.08,17.78 C3.+ | D1.C 6.35,13.97 6.35,16.51 5.08,17.78
N$22
  Bottom 0.305: S9.2 52.41,46.06 52.41,46.01 51.35,44.95 49.85,44.95 48.44,46.35 43.18,46.35 42.05,45.23 42.05,39.56 38.05,35.56 U2.RX
N$23
  Bottom 0.305: S10.2 53.04,39.03 53.04,40.31 47.59,45.77 43.53,45.77 42.81,45.05 42.81,39.05 38.15,34.38 27.9,34.38 27.4,34.89 27.4,36.87 28.57,38.05 U2.TX
N$26
  Bottom 0.305: Q1.3 23.5,97.79 CON1.5
PAD_CLK
  Top 0.305: U3.P$10 55.88,5.08 46.35,5.08 45.09,6.35 40.64,6.35 36.83,10.16 36.83,16.51 35.56,17.78 U2.D6
PAD_DATA
  Top 0.305: U2.D5 34.92,20.32 39.37,15.88 39.37,10.79 41.27,8.89 45.09,8.89 47.62,11.43 47.62,14.61 U3.P$3
PAD_LATCH
  Top 0.305: U3.P$9 55.88,2.54 46.35,2.54 45.09,3.81 38.73,3.81 35.56,6.99 35.56,12.7 33.02,15.24 U2.D7
RST  (via drill 0.35)
  Top 0.305: U2.RST1 36.83,33.02 30.48,39.37 v30.48,42.55
  Bottom 0.305: v30.48,42.55 8.69,42.55 S8.1
SCK
  Top 0.305: U2.DP13 45.09,1.27 87.95,1.27 92.71,6.03 95.57,6.03 98.42,8.89 98.42,48.26 97.16,49.53 CON3.2
SEN_CO
  Top 0.305: U2.A1 46.35,15.24 46.35,64.78 19.05,92.09 19.05,98.42 17.46,100.01 13.65,100.01 12.7,99.06 CON1.1
SEN_EN
  Top 0.305: U2.A0 46.99,13.34 46.99,65.41 32.38,80.01 Q1.2
SEN_NH3
  Top 0.305: U2.A2 45.72,17.14 45.72,64.14 15.24,94.61 CON1.2
SEN_NO2
  Top 0.305: U2.A3 45.09,19.05 45.09,63.5 13.86,94.73 13.86,98.36 14.8,99.3 16.63,99.3 17.78,98.16 CON1.3

### Text on the board
tPlace: TX ESP | RX | MISO | MOSI | S8 | RX ESP | LCD DATA | LCD CLK | MQ9 SIG | TX | 3.3V | 5V | GND | VIN
bPlace: BOZET Herwin / TI 2 Grp. B